# Altium project LCR_Tester.PrjPcb
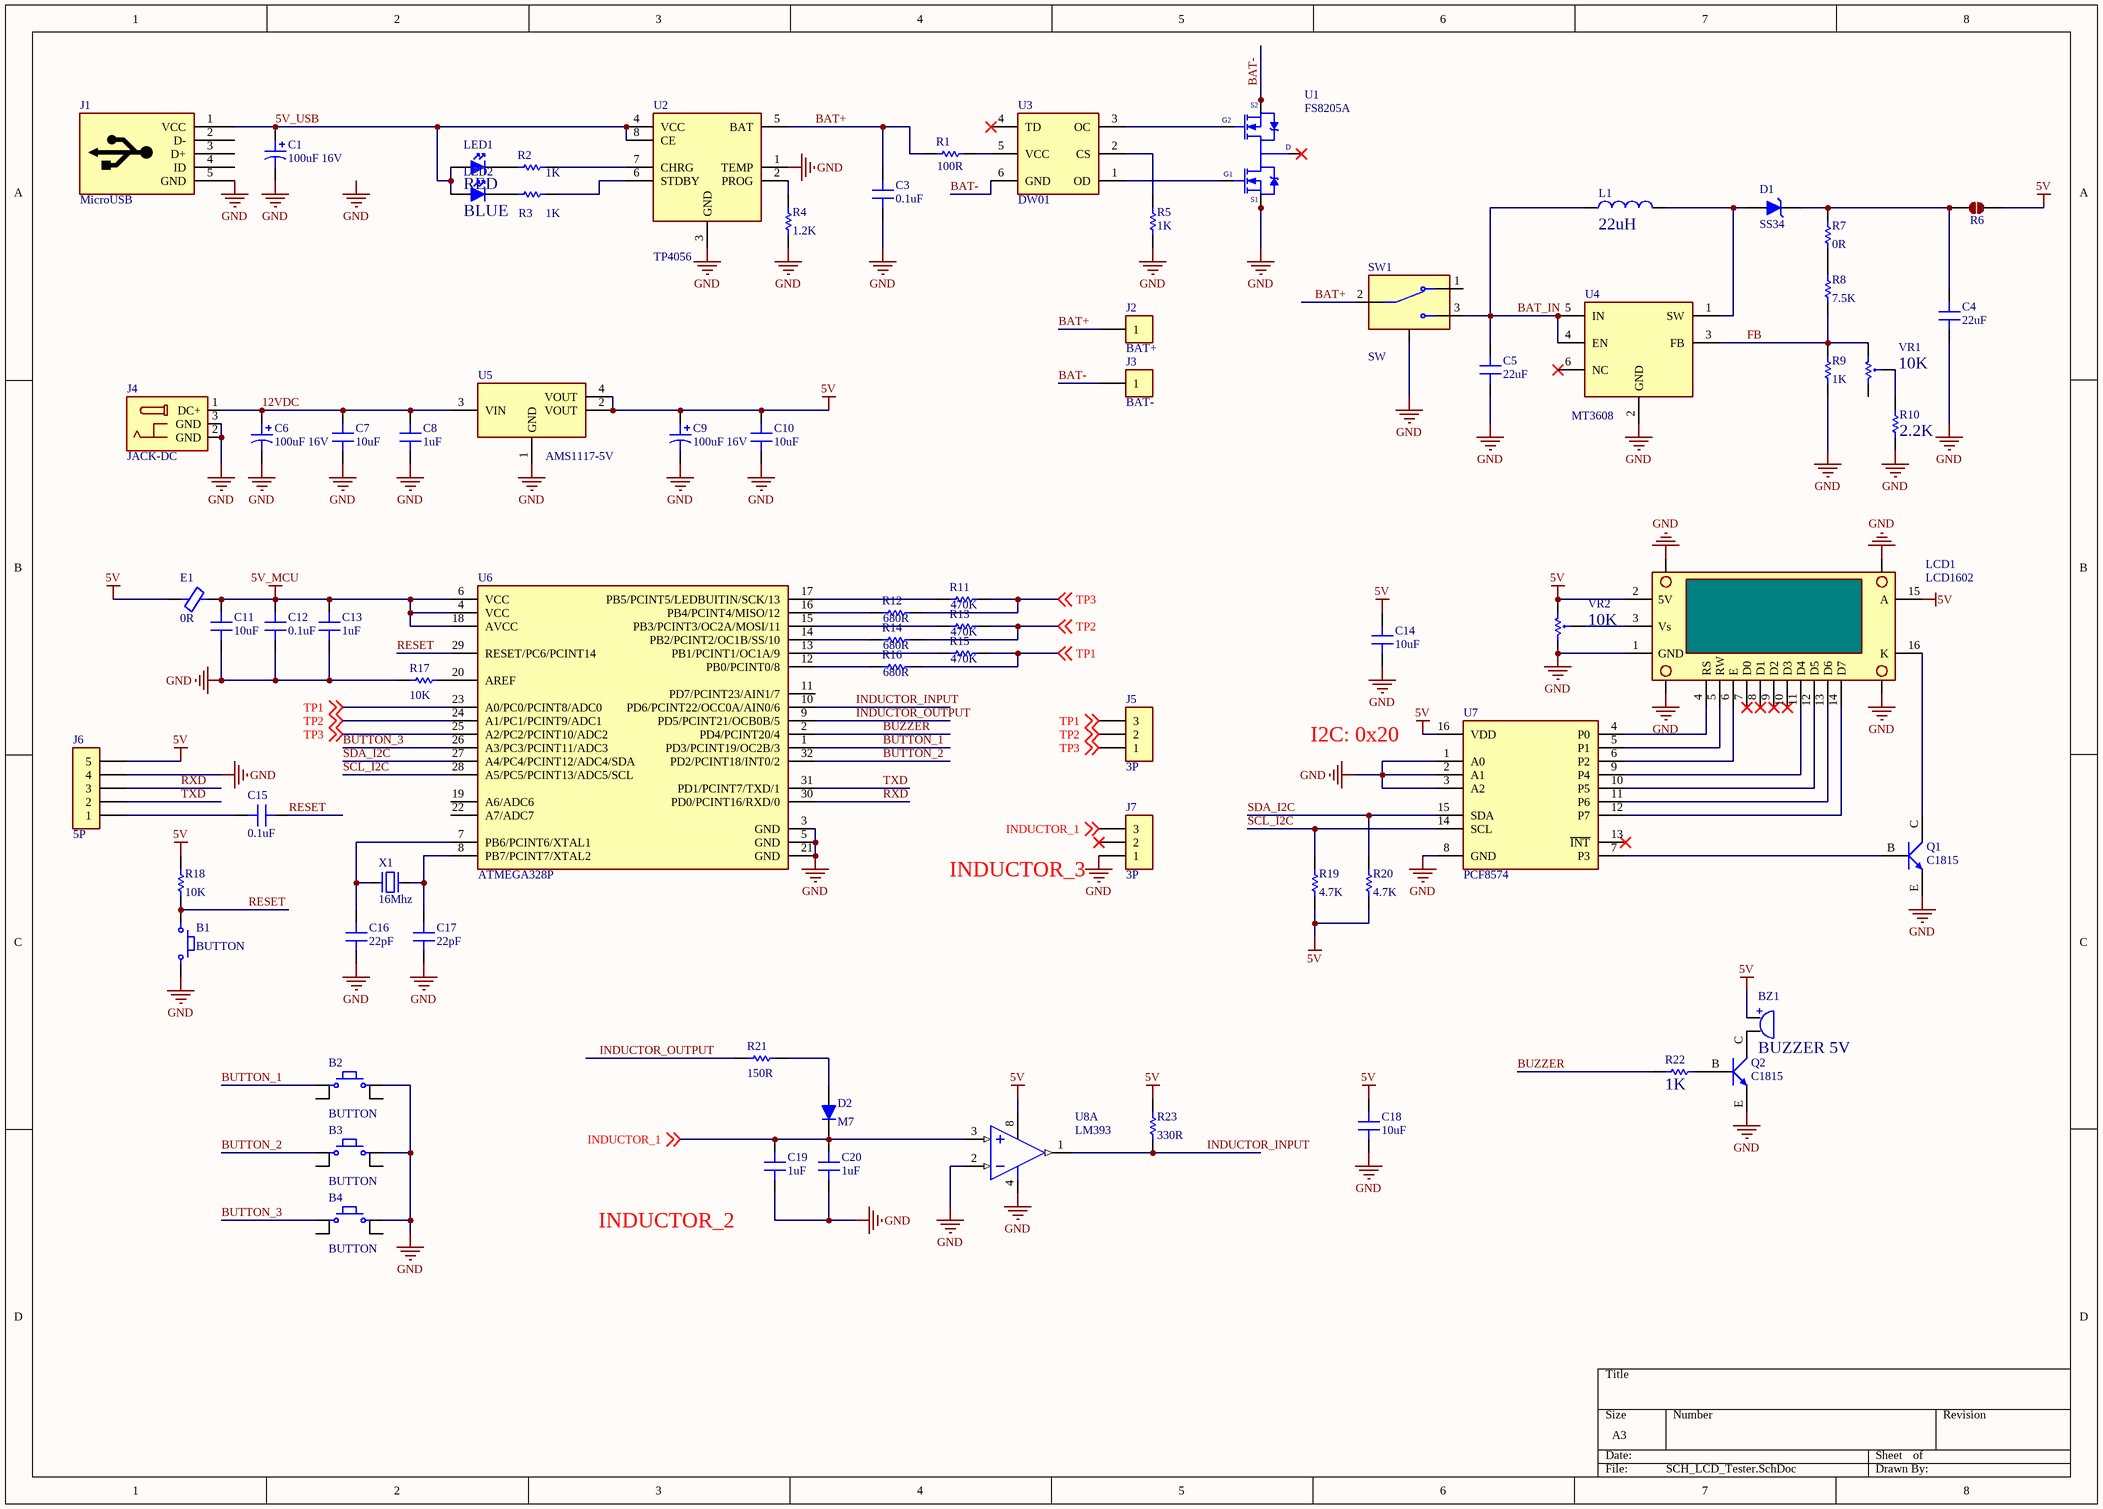
[diagram p0: SCH_LCD_Tester.SchDoc]
1 sheet, 75 parts. Net scope: global (net labels, ports and power ports of the same name join across sheets).
Board file: PCB_LCR_Tester.PcbDoc

## Sheet SCH_LCD_Tester.SchDoc
size A3; SheetNumber: 1; SheetTotal: 1

### Parts
B1  BUTTON  [BUTTON-SMD-2P-3x6x2.5MM]
B2  BUTTON  [BUTTON-DIP-4P-6X6X5MM]
B3  BUTTON  [BUTTON-DIP-4P-6X6X5MM]
B4  BUTTON  [BUTTON-DIP-4P-6X6X5MM]
BZ1  BUZZER 5V  [BUZZER_12095]
C1  100uF 16V  [CAPP-SMD-ALU-6MM]
C3  0.1uF  [CAP-0603]
C4  22uF  [CAP-1206]
C5  22uF  [CAP-1206]
C6  100uF 16V  [CAPP-SMD-ALU-6MM]
C7  10uF  [CAP-0805]
C8  1uF  [CAP-0603]
C9  100uF 16V  [CAPP-SMD-ALU-6MM]
C10  10uF  [CAP-0805]
C11  10uF  [CAP-0805]
C12  0.1uF  [CAP-0603]
C13  1uF  [CAP-0603]
C14  10uF  [CAP-0805]
C15  0.1uF  [CAP-0603]
C16  22pF  [CAP-0603]
C17  22pF  [CAP-0603]
C18  10uF  [CAP-0805]
C19  1uF  [CAP-0603]
C20  1uF  [CAP-0603]
D1  SS34  [DO-214AC]
D2  M7  [DIODE-SMD-SMA]
E1  0R  [FB-0805]
J1  MicroUSB  [USB-FEMALE-MICRO-DIP]
J2  BAT+  [HOLE-M1]
J3  BAT-  [HOLE-M1]
J4  JACK-DC  [JACK-DC-5.5X2.1MM]
J5  3P  [XH2.54-3P-R]
J6  5P  [JUMP-2.54-MALE-5P]
J7  3P  [XH2.54-3P-R]
L1  22uH  [INDUCTOR-SMD-7X7X4MM]
LCD1  LCD1602  [LCD1602]
LED1  RED  [LED-0603-RED]
LED2  BLUE  [LED-0603-BLUE]
Q1  C1815  [SOT-23-BCE]
Q2  C1815  [SOT-23-BCE]
R1  100R  [RES-0603]
R2  1K  [RES-0603]
R3  1K  [RES-0603]
R4  1.2K  [RES-0603]
R5  1K  [RES-0603]
R6  CONNECT PAD  [CONNECT-SOLDER-0603]  (value not drawn)
R7  0R  [RES-0603]
R8  7.5K  [RES-0603]
R9  1K  [RES-0603]
R10  2.2K  [RES-0603]
R11  470K  [RES-0603]
R12  680R  [RES-0603]
R13  470K  [RES-0603]
R14  680R  [RES-0603]
R15  470K  [RES-0603]
R16  680R  [RES-0603]
R17  10K  [RES-0603]
R18  10K  [RES-0603]
R19  4.7K  [RES-0603]
R20  4.7K  [RES-0603]
R21  150R  [RES-0603]
R22  1K  [RES-0603]
R23  330R  [RES-0603]
SW1  SW  [SWITCH-3PIN-R]
U1  FS8205A  [FS8205A]
U2  TP4056  [TP4056]
U3  DW01  [SOT-23-6]
U4  MT3608  [SOT-23-6]
U5  AMS1117-5V  [SOT-223]
U6  ATMEGA328P  [TQFP-32]
U7  PCF8574  [PCF8574]
U8  LM393  [SOP-8]  (part A of 2)
VR1  10K  [VR-SMD]
VR2  10K  [VR-SMD]
X1  16Mhz  [CRYSTAL-SMD]

### Nets
5V: BZ1.1 C9.1(+) C10.2 C14.2 C18.2 E1.1 J6.5 LCD1.2(5V) LCD1.15(A) R6.2 R18.2 R19.1 R20.1 R23.2 U5.2(VOUT) U5.4(VOUT) U7.16(VDD) U8.8(+V) VR2.3
5V_MCU: C11.2 C12.2 C13.2 E1.2 U6.4(VCC) U6.6(VCC) U6.18(AVCC)
GND: B1.2 B2.2 B3.2 B4.2 C1.2(-) C3.1 C4.1 C5.1 C6.2(-) C7.1 C8.1 C9.2(-) C10.1 C11.1 C12.1 C13.1 C14.1 C16.1 C17.1 C18.1 C19.1 C20.1 J1.5(GND) J4.2(GND) J4.3(GND) J6.4 J7.1 LCD1.1(GND) LCD1.H1 LCD1.H2 LCD1.H3 LCD1.H4 Q1.E Q2.E R4.1 R5.2 R9.1 R10.1 R17.1 SW1.0(NO1) U1.2(S1) U1.3(S1) U2.1(TEMP) U2.3(GND) U4.2(GND) U5.1(GND) U6.3(GND) U6.5(GND) U6.21(GND) U7.1(A0) U7.2(A1) U7.3(A2) U7.8(GND) U8.2(IN-) U8.4(-V) VR2.1
5V_USB: C1.1(+) J1.1(VCC) LED1.1(A) LED2.1(A) U2.4(VCC) U2.8(CE)
12VDC: C6.1(+) C7.2 C8.2 J4.1(DC+) U5.3(VIN)
BAT+: C3.2 J2.1 R1.1 SW1.2(COM1) U2.5(BAT)
BAT-: J3.1 U1.6(S2) U1.7(S2) U3.6(GND)
BAT_IN: C5.2 L1.1 SW1.3(NO1) U4.4(EN) U4.5(IN)
BUTTON_1: B2.1 U6.1(PD3/PCINT19/OC2B/3)
BUTTON_2: B3.1 U6.32(PD2/PCINT18/INT0/2)
BUTTON_3: B4.1 U6.26(A3/PC3/PCINT11/ADC3)
BUZZER: R22.1 U6.2(PD4/PCINT20/4)
FB: R8.1 R9.2 U4.3(FB) VR1.3
INDUCTOR_1: C19.2 C20.2 D2.C(K) J7.3 U8.3(IN+) ; off-sheet INDUCTOR_1
INDUCTOR_INPUT: R23.1 U6.10(PD6/PCINT22/OCC0A/AIN0/6) U8.1(OUT)
INDUCTOR_OUTPUT: R21.1 U6.9(PD5/PCINT21/OCB0B/5)
RESET: B1.1 C15.2 R18.1 U6.29(RESET/PC6/PCINT14)
RXD: J6.3 U6.30(PD0/PCINT16/RXD/0)
SCL_I2C: R19.2 U6.28(A5/PC5/PCINT13/ADC5/SCL) U7.14(SCL)
SDA_I2C: R20.2 U6.27(A4/PC4/PCINT12/ADC4/SDA) U7.15(SDA)
TP1: J5.3 R15.2 R16.2 U6.23(A0/PC0/PCINT8/ADC0) ; off-sheet TP1
TP2: J5.2 R13.2 R14.2 U6.24(A1/PC1/PCINT9/ADC1) ; off-sheet TP2
TP3: J5.1 R11.2 R12.2 U6.25(A2/PC2/PCINT10/ADC2) ; off-sheet TP3
TXD: J6.2 U6.31(PD1/PCINT7/TXD/1)
NetBZ1_2: BZ1.2 Q2.C
NetC4_2: C4.2 D1.C R6.1 R7.2
NetC15_1: C15.1 J6.1
NetC16_2: C16.2 U6.7(PB6/PCINT6/XTAL1) X1.2
NetC17_2: C17.2 U6.8(PB7/PCINT7/XTAL2) X1.1
NetD1_A: D1.A L1.2 U4.1(SW)
NetD2_A: D2.A R21.2
NetLCD1_3: LCD1.3(Vs) VR2.2
NetLCD1_4: LCD1.4(RS) U7.4(P0)
NetLCD1_5: LCD1.5(RW) U7.5(P1)
NetLCD1_6: LCD1.6(E) U7.6(P2)
NetLCD1_11: LCD1.11(D4) U7.9(P4)
NetLCD1_12: LCD1.12(D5) U7.10(P5)
NetLCD1_13: LCD1.13(D6) U7.11(P6)
NetLCD1_14: LCD1.14(D7) U7.12(P7)
NetLCD1_16: LCD1.16(K) Q1.C
NetLED1_2: LED1.2(K) R2.2
NetLED2_2: LED2.2(K) R3.2
NetQ1_B: Q1.B U7.7(P3)
NetQ2_B: Q2.B R22.2
NetR1_2: R1.2 U3.5(VCC)
NetR2_1: R2.1 U2.7(CHRG)
NetR3_1: R3.1 U2.6(STDBY)
NetR4_2: R4.2 U2.2(PROG)
NetR5_1: R5.1 U3.2(CS)
NetR7_1: R7.1 R8.2
NetR10_2: R10.2 VR1.2
NetR11_1: R11.1 U6.17(PB5/PCINT5/LEDBUITIN/SCK/13)
NetR12_1: R12.1 U6.16(PB4/PCINT4/MISO/12)
NetR13_1: R13.1 U6.15(PB3/PCINT3/OC2A/MOSI/11)
NetR14_1: R14.1 U6.14(PB2/PCINT2/OC1B/SS/10)
NetR15_1: R15.1 U6.13(PB1/PCINT1/OC1A/9)
NetR16_1: R16.1 U6.12(PB0/PCINT0/8)
NetR17_2: R17.2 U6.20(AREF)
NetU1_1: U1.1(D12) U1.8(D12)
NetU1_4: U1.4(G1) U3.1(OD)
NetU1_5: U1.5(G2) U3.3(OC)

Not connected (* = marked no-connect by the designer): B2 3 4; B3 3 4; B4 3 4; J1 2(D-) 3(D+) 4(ID); J7 2*; LCD1 7(D0)* 8(D1)* 9(D2)* 10(D3)*; SW1 1(NC1); U3 4(TD)*; U4 6(NC)*; U6 11(PD7/PCINT23/AIN1/7) 19(A6/ADC6) 22(A7/ADC7); U7 13(~{INT})*; VR1 1

### Notes on the sheet
- I2C: 0x20
- (near J7) INDUCTOR_3
- INDUCTOR_2
- Labels drawn without touching a wire or pin: GND
- (in symbol CL07577) D
- (in symbol CLA2022) +

### Library data of the parts
B1 = CLA1750: Nút nhấn 2 chân dán 3x6x2.5mm; Manufacture: Linh kiện chất lượng; Partnumber: CLA1750; Value: BUTTON; Creator: dauthanhtrung.kma; Category: BUTTON; Mounting type: SMD; Detailed Value: BUTTON
B2-B4 = CLA4900: Nút nhấn 4 chân 6x6x5mm; Manufacture: Linh kiện chất lượng; Partnumber: CLA4900; Value: BUTTON; Creator: dauthanhtrung.kma; Category: BUTTON; Mounting type: TH; Detailed Value: BUTTON
BZ1 = CLA2022: Còi chíp 5V 12095 12x9.5mm; Manufacture: Linh kiện chất lượng; Link sale: #http://linhkienchatluong.vn/buzzer---coi-chip---coi-bao/coi-chip-5v-12095-12x95mm_sp798_ct4243.aspx#; Partnumber: CLA2022; Value: BUZZER 5V; Creator: dauthanhtrung.kma; Category: BUZZER; Mounting type: TH; Detailed Value: BUZZER 5V
C1 C6 C9 = CLA1046: Tụ nhôm 16V 100uF 6.3x5.4mm; Manufacture: Linh kiện chất lượng; Partnumber: CLA1046; Value: 100uF 16V; Creator: dauthanhtrung.kma; Category: CAPACITOR; Mounting type: SMD; Detailed Value: 100uF 16V
C3 C12 C15 = CLA4098: Tụ dán 0603 104-100nF 0.1uF 50V 10%; Manufacture: Linh kiện chất lượng; Link sale: #http://linhkienchatluong.vn/tu-dan-0603/tu-dan-0603-104-100nf-01uf-50v-10-10c_sp1063_ct14618.aspx#; Detailed Value: 0603 0.1uF; Partnumber: CLA4098; Value: 0.1uF; Creator: dauthanhtrung.kma; Category: CAPACITOR; Mounting type: SMD
C4 C5 = CLA3577: Tụ dán 1206 226-22uF 16V 10% X5R; Manufacture: Linh kiện chất lượng; Detailed Value: 1206 22uF; Partnumber: CLA3577; Value: 22uF; Creator: dauthanhtrung.kma; Category: CAPACITOR; Mounting type: SMD
C7 C10 C11 C14 C18 = CLA4020: Tụ dán 0805 106-10uF 16V 10%; Manufacture: Linh kiện chất lượng; Link sale: #http://linhkienchatluong.vn/tu-dan-0805/tu-dan-0805-106-10uf-16v-10-10c_sp1293_ct14702.aspx#; Detailed Value: 0805 10uF; Partnumber: CLA4020; Value: 10uF; Creator: dauthanhtrung.kma; Category: CAPACITOR; Mounting type: SMD
C8 C13 C19 C20 = CLA4103: Tụ dán 0603 105-1uF 25V 10%; Manufacture: Linh kiện chất lượng; Link sale: #http://linhkienchatluong.vn/tu-dan-0603/tu-dan-0603-105-1uf-25v-10-10c_sp1063_ct14623.aspx#; Detailed Value: 0603 1uF; Partnumber: CLA4103; Value: 1uF; Creator: dauthanhtrung.kma; Category: CAPACITOR; Mounting type: SMD
C16 C17 = CLA1297: Tụ dán 0603 22pF 50V 5%; Manufacture: Linh kiện chất lượng; Partnumber: CLA1297; Value: 22pF; Creator: dauthanhtrung.kma; Category: CAPACITOR; Mounting type: SMD; Detailed Value: 0603 22pF
D1 = CLA1496: SS34 SMA 3A 40V DO-214AC Schottky Barrier Diode chính hãng MIC; Partnumber: CLA1496; Manufacture: MIC; Value: SS34; Creator: dauthanhtrung.kma; Category: DIODE; Mounting type: SMD; Detailed Value: SS34 SMA 3A 40V
D2 = CL08612: 1N4007 M7 SMA Diode chỉnh lưu 1A 1000V; Manufacture: Linh kiện chất lượng; Detailed Value: DIODE M7; Partnumber: CL08612; Value: M7; Creator: dauthanhtrung.kma; Category: DIODE; Mounting type: SMD
E1 = CL07788: Ferrite Beads 0805 0R; Manufacture: Linh kiện chất lượng; Detailed Value: 0R 0805; Partnumber: CL07788; Value: 0R; Creator: dauthanhtrung.kma; Category: FERRITE; Mounting type: SMD
J1 = CL08132: Cổng MicroUSB MK5P 5P chân dán chốt cắm DIP; Part number: USB-B-Mini; Manufacture: Linh kiện chất lượng; Partnumber: CL08132; Value: MicroUSB; Creator: dauthanhtrung.kma; Category: CONNECTOR; Mounting type: TH; Detailed Value: MicroUSB
J2 J3 = HOLE-1MM: Lỗ 1mm M1; Manufacture: KMA Electrical; Partnumber: HOLE-1MM; Value: 1MM; Creator: dauthanhtrung.kma; Category: CONNECTOR; Mounting type: TH; Detailed Value: HOLE-M1
J4 = CLA2007: Jack nguồn DC cái 5.5x2.1mm; Manufacture: Linh kiện chất lượng; Partnumber: CLA2007; Value: JACK-DC; Creator: dauthanhtrung.kma; Category: CONNECTOR; Mounting type: TH; Detailed Value: JACK-DC
J5 J7 = CLA1888: Header đực 3P XH2.54-3P chân cong; Manufacture: Linh kiện chất lượng; Link sale: #http://linhkienchatluong.vn/header-xh254-trang/header-duc-3p-xh254-3p-chan-cong-10c_sp861_ct1703.aspx#; Partnumber: CLA1888; Value: 3P; Creator: dauthanhtrung.kma; Category: CONNECTOR; Mounting type: TH; Detailed Value: XH2.54-3P-R
J6 = JUMP-2.54-MALE-5P: Jump đực đơn 2.54mm 5P chân thẳng; Manufacture: Linh kiện chất lượng; Link sale: #http://linhkienchatluong.vn/jump-254mm/jump-duc-don-254mm-1x40p-chan-thang_sp878_ct1725.aspx#; Partnumber: JUMP-2.54-MALE-5P; Value: 5P; Creator: dauthanhtrung.kma; Category: CONNECTOR; Mounting type: TH; Detailed Value: JUMP-2.54-MALE-5P
L1 = CLA1397: Cuộn cảm dán 22uH CD74R-220 7x7x4mm; Manufacture: Linh kiện chất lượng; Partnumber: CLA1397; Value: 22uH; Creator: dauthanhtrung.kma; Category: INDUCTOR; Mounting type: SMD; Detailed Value: 22uH
LCD1 = CLA2106: Màn hình LCD1602 5V 16x2 xanh dương; Manufacture: Linh kiện chất lượng; Partnumber: CLA2106; Value: LCD1602; Creator: dauthanhtrung.kma; Category: MODULE; Mounting type: TH; Detailed Value: LCD1602
LED1 = CLA3853: LED dán 0603 màu đỏ; Manufacture: Linh kiện chất lượng; Detailed Value: LED 0603 RED; Partnumber: CLA3853; Value: RED; Creator: dauthanhtrung.kma; Category: LED; Mounting type: SMD
LED2 = CLA3855: LED dán 0603 màu xanh dương; Manufacture: Linh kiện chất lượng; Detailed Value: LED 0603 BLUE; Partnumber: CLA3855; Value: BLUE; Creator: dauthanhtrung.kma; Category: LED; Mounting type: SMD
Q1 Q2 = CL06381: C1815 HF NPN Transistor 0.15A 60V SOT-23 chính hãng JCET; Detailed Value: C1815 NPN SOT-23; Partnumber: CL06381; Manufacture: JCET; Value: C1815; Creator: dauthanhtrung.kma; Category: TRANSISTOR; Mounting type: SMD
R1 = CLA0725: Điện trở dán 0603 100R 1%; Manufacture: Linh kiện chất lượng; Link sale: #http://linhkienchatluong.vn/dien-tro-dan-0603-116w/dien-tro-dan-0603-100r-1-50c_sp836_ct5753.aspx#; Partnumber: CLA0725; Value: 100R; Creator: dauthanhtrung.kma; Category: RESISTOR; Mounting type: SMD; Detailed Value: 0603 100R
R2 R3 R5 R9 R22 = CLA0742: Điện trở dán 0603 1K 1%; Manufacture: Linh kiện chất lượng; Link sale: #http://linhkienchatluong.vn/dien-tro-dan-0603-116w/dien-tro-dan-0603-1k-1-50c_sp836_ct5772.aspx#; Detailed Value: 0603 1K; Partnumber: CLA0742; Value: 1K; Creator: dauthanhtrung.kma; Category: RESISTOR; Mounting type: SMD
R4 = CLA0743: Điện trở dán 0603 1.2K 1%; Manufacture: Linh kiện chất lượng; Partnumber: CLA0743; Value: 1.2K; Creator: dauthanhtrung.kma; Category: RESISTOR; Mounting type: SMD; Detailed Value: 0603 1.2K
R6 = CONNECT-PAD: CONNECT PAD Điểm chờ hàn (chọn chế độ) 0603; Manufacture: KMA Electrical; Partnumber: CONNECT-PAD; Value: CONNECT PAD; Creator: dauthanhtrung.kma; Category: RESISTOR; Mounting type: SMD
R7 = CLA0702: Điện trở dán 0603 0R 1%; Manufacture: Linh kiện chất lượng; Link sale: #http://linhkienchatluong.vn/dien-tro-dan-0603-116w/dien-tro-dan-0603-0r-1-50c_sp836_ct5720.aspx#; Detailed Value: 0603 0R; Partnumber: CLA0702; Value: 0R; Creator: dauthanhtrung.kma; Category: RESISTOR; Mounting type: SMD
R8 = CL05809: Điện trở dán 0603 7.5K 1%; Manufacture: Linh kiện chất lượng; Partnumber: CL05809; Value: 7.5K; Creator: dauthanhtrung.kma; Category: RESISTOR; Mounting type: SMD; Detailed Value: 0603 7.5K
R10 = CL05931: Điện trở dán 0603 2.2K 1%; Manufacture: Linh kiện chất lượng; Partnumber: CL05931; Value: 2.2K; Creator: dauthanhtrung.kma; Category: RESISTOR; Mounting type: SMD; Detailed Value: 0603 2.2K
R11 R13 R15 = CL06618: Điện trở dán 0603 470K 1%; Manufacture: Linh kiện chất lượng; Partnumber: CL06618; Value: 470K; Creator: dauthanhtrung.kma; Category: RESISTOR; Mounting type: SMD; Detailed Value: 0603 470K
R12 R14 R16 = CLA0739: Điện trở dán 0603 680R 1%; Manufacture: Linh kiện chất lượng; Partnumber: CLA0739; Value: 680R; Creator: dauthanhtrung.kma; Category: RESISTOR; Mounting type: SMD; Detailed Value: 0603 680R
R17 R18 = CLA0759: Điện trở dán 0603 10K 1%; Manufacture: Linh kiện chất lượng; Link sale: #http://linhkienchatluong.vn/dien-tro-dan-0603-116w/dien-tro-dan-0603-10k-1-50c_sp836_ct5792.aspx#; Partnumber: CLA0759; Value: 10K; Creator: dauthanhtrung.kma; Category: RESISTOR; Mounting type: SMD; Detailed Value: 0603  10K
R19 R20 = CL05810: Điện trở dán 0603 4.7K 1%; Manufacture: Linh kiện chất lượng; Link sale: #http://linhkienchatluong.vn/dien-tro-dan-0603-116w/dien-tro-dan-0603-47k-1-50c_sp836_ct5784.aspx#; Partnumber: CL05810; Value: 4.7K; Creator: dauthanhtrung.kma; Category: RESISTOR; Mounting type: SMD; Detailed Value: 0603 4.7K
R21 = CLA0727: Điện trở dán 0603 150R 1%; Manufacture: Linh kiện chất lượng; Partnumber: CLA0727; Value: 150R; Creator: dauthanhtrung.kma; Category: RESISTOR; Mounting type: SMD; Detailed Value: 0603 150R
R23 = CL06621: Điện trở dán 0603 330R 1%; Manufacture: Linh kiện chất lượng; Link sale: #http://linhkienchatluong.vn/dien-tro-dan-0603-116w/dien-tro-dan-0603-330r-1-50c_sp836_ct8907.aspx#; Partnumber: CL06621; Value: 330R; Creator: dauthanhtrung.kma; Category: RESISTOR; Mounting type: SMD; Detailed Value: 0603 330R
SW1 = CLA1810: Công tắc gạt SK12D07VG4 tay gạt nằm ngang; Manufacture: Linh kiện chất lượng; Detailed Value: SW 3P; Partnumber: CLA1810; Value: SW; Creator: dauthanhtrung.kma; Category: SWITCH; Mounting type: TH
U1 = CL07577: FS8205A Dual N-Mosfet TSSOP-8 chính hãng FORTUNE; Manufacture: Linh kiện chất lượng; Partnumber: CL07577; Value: FS8205A; Creator: dauthanhtrung.kma; Category: IC; Mounting type: SMD; Detailed Value: FS8205A
U2 = CL00993: TP4056 SOP-8 chính hãng TPS; Manufacture: Linh kiện chất lượng; Partnumber: CL00993; Value: TP4056; Creator: dauthanhtrung.kma; Category: IC; Mounting type: SMD; Detailed Value: TP4056
U3 = CL01697: DW01A SOT23-6 IC bảo vệ PIN chính hãng FMSuperChip; Manufacture: Linh kiện chất lượng; Partnumber: CL01697; Value: DW01A; Creator: dauthanhtrung.kma; Category: IC; Mounting type: SMD; Detailed Value: DW01A
U4 = CL05404: MT3608 B628x SOP-6 2A chính hãng MT; Manufacture: Linh kiện chất lượng; MF: Aerosemi Technology Co., Ltd; Package: Package Analog Devices; Availability: Unavailable; Value: MT3608; MP: MT3608; SnapEDA_Link: https://www.snapeda.com/parts/MT3608/Aerosemi%20Technology%20Co.%2C%20Ltd/view-part/3218014/?ref=snap; Price: None; Partnumber: CL05404; Creator: dauthanhtrung.kma; Category: IC; Mounting type: SMD; Detailed Value: MT3608
U5 = CL00250: AMS1117-5V IC ổn áp 5V 1A SOT-223; Manufacture: Linh kiện chất lượng; Partnumber: CL00250; Value: AMS1117-5V; Creator: dauthanhtrung.kma; Category: IC; Mounting type: SMD; Detailed Value: AMS1117-5V
U6 = CL00292: ATMEGA328P-AU TQFP-32 chính hãng ATMEL; MP: STM8S003F3P6; MF: STMicroelectronics; Availability: Unavailable; SnapEDA_Link: https://www.snapeda.com/parts/STM8S003F3P6/STMicroelectronics/view-part/47650/?ref=snap; Price: None; Value: ATMEGA328P; Package: TSSOP-20 STMicroelectronics; Partnumber: CL00292; Manufacture: ATMEL; Creator: dauthanhtrung.kma; Category: IC; Mounting type: SMD; Detailed Value: ATMEGA328P-AU
U7 = CL00804: PCF8574 PCF8574DWR SOIC-16 I2C LCD1602 LCD2004 chính hãng TI; Manufacture: TEXAS INSTRUMENT; MP: STM8S003F3P6; MF: STMicroelectronics; Availability: Unavailable; SnapEDA_Link: https://www.snapeda.com/parts/STM8S003F3P6/STMicroelectronics/view-part/47650/?ref=snap; Price: None; Value: PCF8574; Package: TSSOP-20 STMicroelectronics; Partnumber: CL00804; Creator: dauthanhtrung.kma; Category: IC; Mounting type: SMD; Detailed Value: PCF8574
U8 = CL00708: LM393 LM393DR SOP-8 chính hãng TI; Manufacture: TEXAS INSTRUMENT; Partnumber: CL00708; Value: LM393; Creator: dauthanhtrung.kma; Category: IC; Mounting type: SMD; Detailed Value: LM393
VR1 VR2 = CLA3212: Biến trở dán 3x3mm 10K EVM3ESX50B14; Manufacture: Linh kiện chất lượng; Partnumber: CLA3212; Value: 10K; Creator: dauthanhtrung.kma; Category: VR; Mounting type: SMD; Detailed Value: 10K
X1 = CLA1602: Thạch anh 16Mhz 49SMD; Manufacture: Linh kiện chất lượng; Partnumber: CLA1602; Value: 16Mhz; Creator: dauthanhtrung.kma; Category: CRYSTAL; Mounting type: SMD; Detailed Value: 16Mhz

## Assembly variants
LCR_Tester: not fitted J7